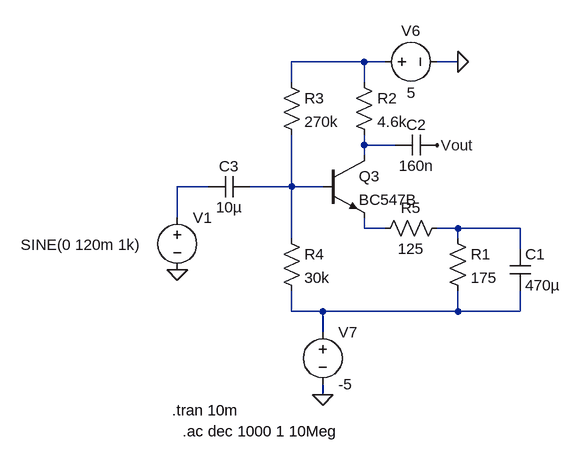
[diagram p0: schematic gain_stage.asc]
gain_stage.asc, the LTspice schematic file:
Version 4
SHEET 1 1584 680
WIRE 1088 -80 976 -80
WIRE 1120 -80 1088 -80
WIRE 1232 -80 1200 -80
WIRE 976 -48 976 -80
WIRE 1088 -48 1088 -80
WIRE 1088 48 1088 32
WIRE 1136 48 1088 48
WIRE 1088 64 1088 48
WIRE 848 112 800 112
WIRE 976 112 976 32
WIRE 976 112 912 112
WIRE 1024 112 976 112
WIRE 800 160 800 112
WIRE 1088 176 1088 160
WIRE 1120 176 1088 176
WIRE 1232 176 1200 176
WIRE 1328 176 1232 176
WIRE 976 192 976 112
WIRE 1232 192 1232 176
WIRE 1328 208 1328 176
WIRE 976 304 976 272
WIRE 1024 304 976 304
WIRE 1232 304 1232 272
WIRE 1232 304 1024 304
WIRE 1328 304 1328 272
WIRE 1328 304 1232 304
WIRE 1024 336 1024 304
WIRE 1024 432 1024 416
FLAG 1024 432 0
FLAG 1232 -80 0
FLAG 1200 48 Vout
FLAG 800 240 0
SYMBOL npn 1024 64 R0
SYMATTR InstName Q3
SYMATTR Value BC547B
SYMBOL res 1216 176 R0
SYMATTR InstName R1
SYMATTR Value 175
SYMBOL cap 1312 208 R0
SYMATTR InstName C1
SYMATTR Value 470µ
SYMBOL res 1072 -64 R0
SYMATTR InstName R2
SYMATTR Value 4.6k
SYMBOL cap 1200 32 R90
WINDOW 0 0 32 VBottom 2
WINDOW 3 32 32 VTop 2
SYMATTR InstName C2
SYMATTR Value 160n
SYMBOL res 960 -64 R0
SYMATTR InstName R3
SYMATTR Value 270k
SYMBOL res 960 176 R0
SYMATTR InstName R4
SYMATTR Value 30k
SYMBOL voltage 1104 -80 R270
WINDOW 0 32 56 VTop 2
WINDOW 3 -32 56 VBottom 2
WINDOW 123 0 0 Left 0
WINDOW 39 0 0 Left 0
SYMATTR InstName V6
SYMATTR Value 5
SYMBOL voltage 1024 320 R0
SYMATTR InstName V7
SYMATTR Value -5
SYMBOL voltage 800 144 R0
WINDOW 3 -241 57 Left 2
WINDOW 123 0 0 Left 0
WINDOW 39 0 0 Left 0
SYMATTR Value SINE(0 120m 1k)
SYMATTR InstName V1
SYMBOL cap 912 96 R90
WINDOW 0 0 32 VBottom 2
WINDOW 3 32 32 VTop 2
SYMATTR InstName C3
SYMATTR Value 10µ
SYMBOL res 1216 160 R90
WINDOW 0 0 56 VBottom 2
WINDOW 3 32 56 VTop 2
SYMATTR InstName R5
SYMATTR Value 125
TEXT 792 456 Left 2 !.tran 10m
TEXT 808 488 Left 2 !.ac dec 1000 1 10Meg

The netlist it stands for:
* gain_stage.asc
Q3 N002 N004 N005 0 BC547B
R1 N006 N007 175
C1 N006 N007 470µ
R2 N001 N002 4.6k
C2 Vout N002 160n
R3 N001 N004 270k
R4 N004 N007 30k
V6 N001 0 5
V7 N007 0 -5
V1 N003 0 SINE(0 120m 1k)
C3 N004 N003 10µ
R5 N006 N005 125
.model NPN NPN
.model PNP PNP
.lib standard.bjt
.tran 10m
.ac dec 1000 1 10Meg
.backanno
.end